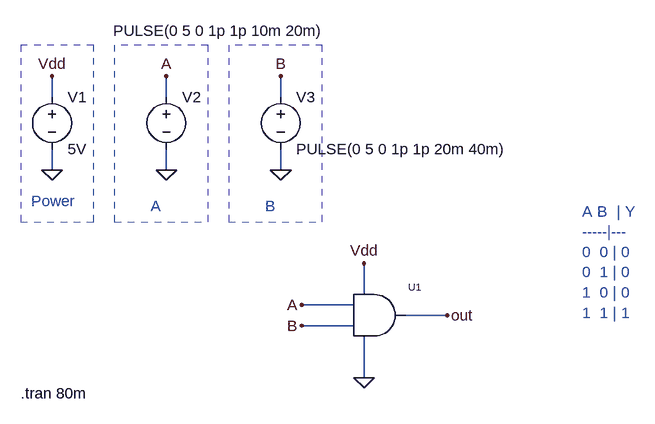
[diagram p0: schematic and_block.asc]
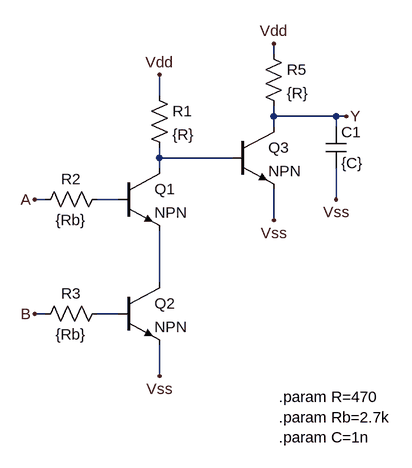
[diagram p1: sub-circuit and.asc]
and_block.asc, the LTspice schematic file:
Version 4
SHEET 1 880 680
WIRE -560 -416 -560 -448
WIRE -384 -416 -384 -448
WIRE -208 -416 -208 -448
WIRE -560 -304 -560 -336
WIRE -384 -304 -384 -336
WIRE -208 -304 -208 -336
WIRE -80 -112 -80 -160
WIRE -96 -96 -176 -96
WIRE 48 -80 -16 -80
WIRE -96 -64 -176 -64
WIRE -80 16 -80 -48
FLAG 48 -80 out
FLAG -176 -96 A
FLAG -80 -160 Vdd
FLAG -80 16 0
FLAG -560 -304 0
FLAG -560 -448 Vdd
FLAG -384 -304 0
FLAG -384 -448 A
FLAG -176 -64 B
FLAG -208 -304 0
FLAG -208 -448 B
SYMBOL voltage -560 -432 R0
WINDOW 123 0 0 Left 0
WINDOW 39 0 0 Left 0
SYMATTR InstName V1
SYMATTR Value 5V
SYMBOL voltage -384 -432 R0
WINDOW 123 0 0 Left 0
WINDOW 39 0 0 Left 0
WINDOW 3 -82 -86 Left 2
SYMATTR Value PULSE(0 5 0 1p 1p 10m 20m)
SYMATTR InstName V2
SYMBOL voltage -208 -432 R0
WINDOW 123 0 0 Left 0
WINDOW 39 0 0 Left 0
SYMATTR InstName V3
SYMATTR Value PULSE(0 5 0 1p 1p 20m 40m)
SYMBOL and -96 -48 R0
SYMATTR InstName U1
TEXT -592 -256 Left 2 ;Power
TEXT -408 -248 Left 2 ;A
TEXT -608 40 Left 2 !.tran 80m
TEXT -232 -248 Left 2 ;B
TEXT 256 -240 Left 2 ;A B  | Y\n-----|---\n0  0 | 0\n0  1 | 0\n1  0 | 0\n1  1 | 1
RECTANGLE Normal -496 -496 -608 -224 2
RECTANGLE Normal -320 -496 -464 -224 2
RECTANGLE Normal -144 -496 -288 -224 2

and.asc, the sub-circuit schematic file:
Version 4
SHEET 1 880 680
WIRE -64 -224 -64 -240
WIRE -240 -160 -240 -192
WIRE -64 -128 -64 -144
WIRE 32 -128 -64 -128
WIRE 48 -128 32 -128
WIRE -64 -112 -64 -128
WIRE 32 -112 32 -128
WIRE -240 -64 -240 -80
WIRE -128 -64 -240 -64
WIRE -240 -48 -240 -64
WIRE -416 0 -432 0
WIRE -304 0 -336 0
WIRE 32 0 32 -48
WIRE -64 32 -64 -16
WIRE -240 128 -240 48
WIRE -416 176 -432 176
WIRE -304 176 -336 176
WIRE -240 272 -240 224
FLAG -240 272 Vss
FLAG -240 -192 Vdd
FLAG -432 176 B
FLAG -432 0 A
FLAG 32 0 Vss
FLAG -64 32 Vss
FLAG -64 -240 Vdd
FLAG 48 -128 Y
SYMBOL npn -304 -48 R0
SYMATTR InstName Q1
SYMBOL npn -304 128 R0
SYMATTR InstName Q2
SYMBOL res -256 -176 R0
SYMATTR InstName R1
SYMATTR Value {R}
SYMBOL res -320 -16 R90
WINDOW 0 0 56 VBottom 2
WINDOW 3 32 56 VTop 2
SYMATTR InstName R2
SYMATTR Value {Rb}
SYMBOL res -320 160 R90
WINDOW 0 0 56 VBottom 2
WINDOW 3 32 56 VTop 2
SYMATTR InstName R3
SYMATTR Value {Rb}
SYMBOL cap 16 -112 R0
SYMATTR InstName C1
SYMATTR Value {C}
SYMBOL npn -128 -112 R0
SYMATTR InstName Q3
SYMBOL res -80 -240 R0
SYMATTR InstName R5
SYMATTR Value {R}
TEXT -56 304 Left 2 !.param R=470\n.param Rb=2.7k\n.param C=1n

The netlist it stands for:
* and_block.asc
V1 Vdd 0 5V
V2 A 0 PULSE(0 5 0 1p 1p 10m 20m)
V3 B 0 PULSE(0 5 0 1p 1p 20m 40m)
XU1 A B out Vdd 0 and

* block symbol definitions
.subckt and A B Y Vdd Vss
Q1 N001 N002 N003 0 NPN
Q2 N003 N004 Vss 0 NPN
R1 Vdd N001 {R}
R2 N002 A {Rb}
R3 N004 B {Rb}
C1 Y Vss {C}
Q3 Y N001 Vss 0 NPN
R5 Vdd Y {R}
.param R=470
.param Rb=2.7k
.param C=1n
.ends and

.model NPN NPN
.model PNP PNP
.lib standard.bjt
* Power
* A
.tran 80m
* B
* A B  | Y
* -----|---
* 0  0 | 0
* 0  1 | 0
* 1  0 | 0
* 1  1 | 1
.backanno
.end